# Altium schematic sheet Sheet1.SchDoc: Communications Modules
size A3; DrawnBy: Igor Bubanja, Tim Oorschot; Organization: Group 7; Address1: ECE Department; Address2: University of Canterbury; Address3: Christchurch 8041; Address4: New Zealand; Revision: 1; SheetNumber: 3; SheetTotal: 3
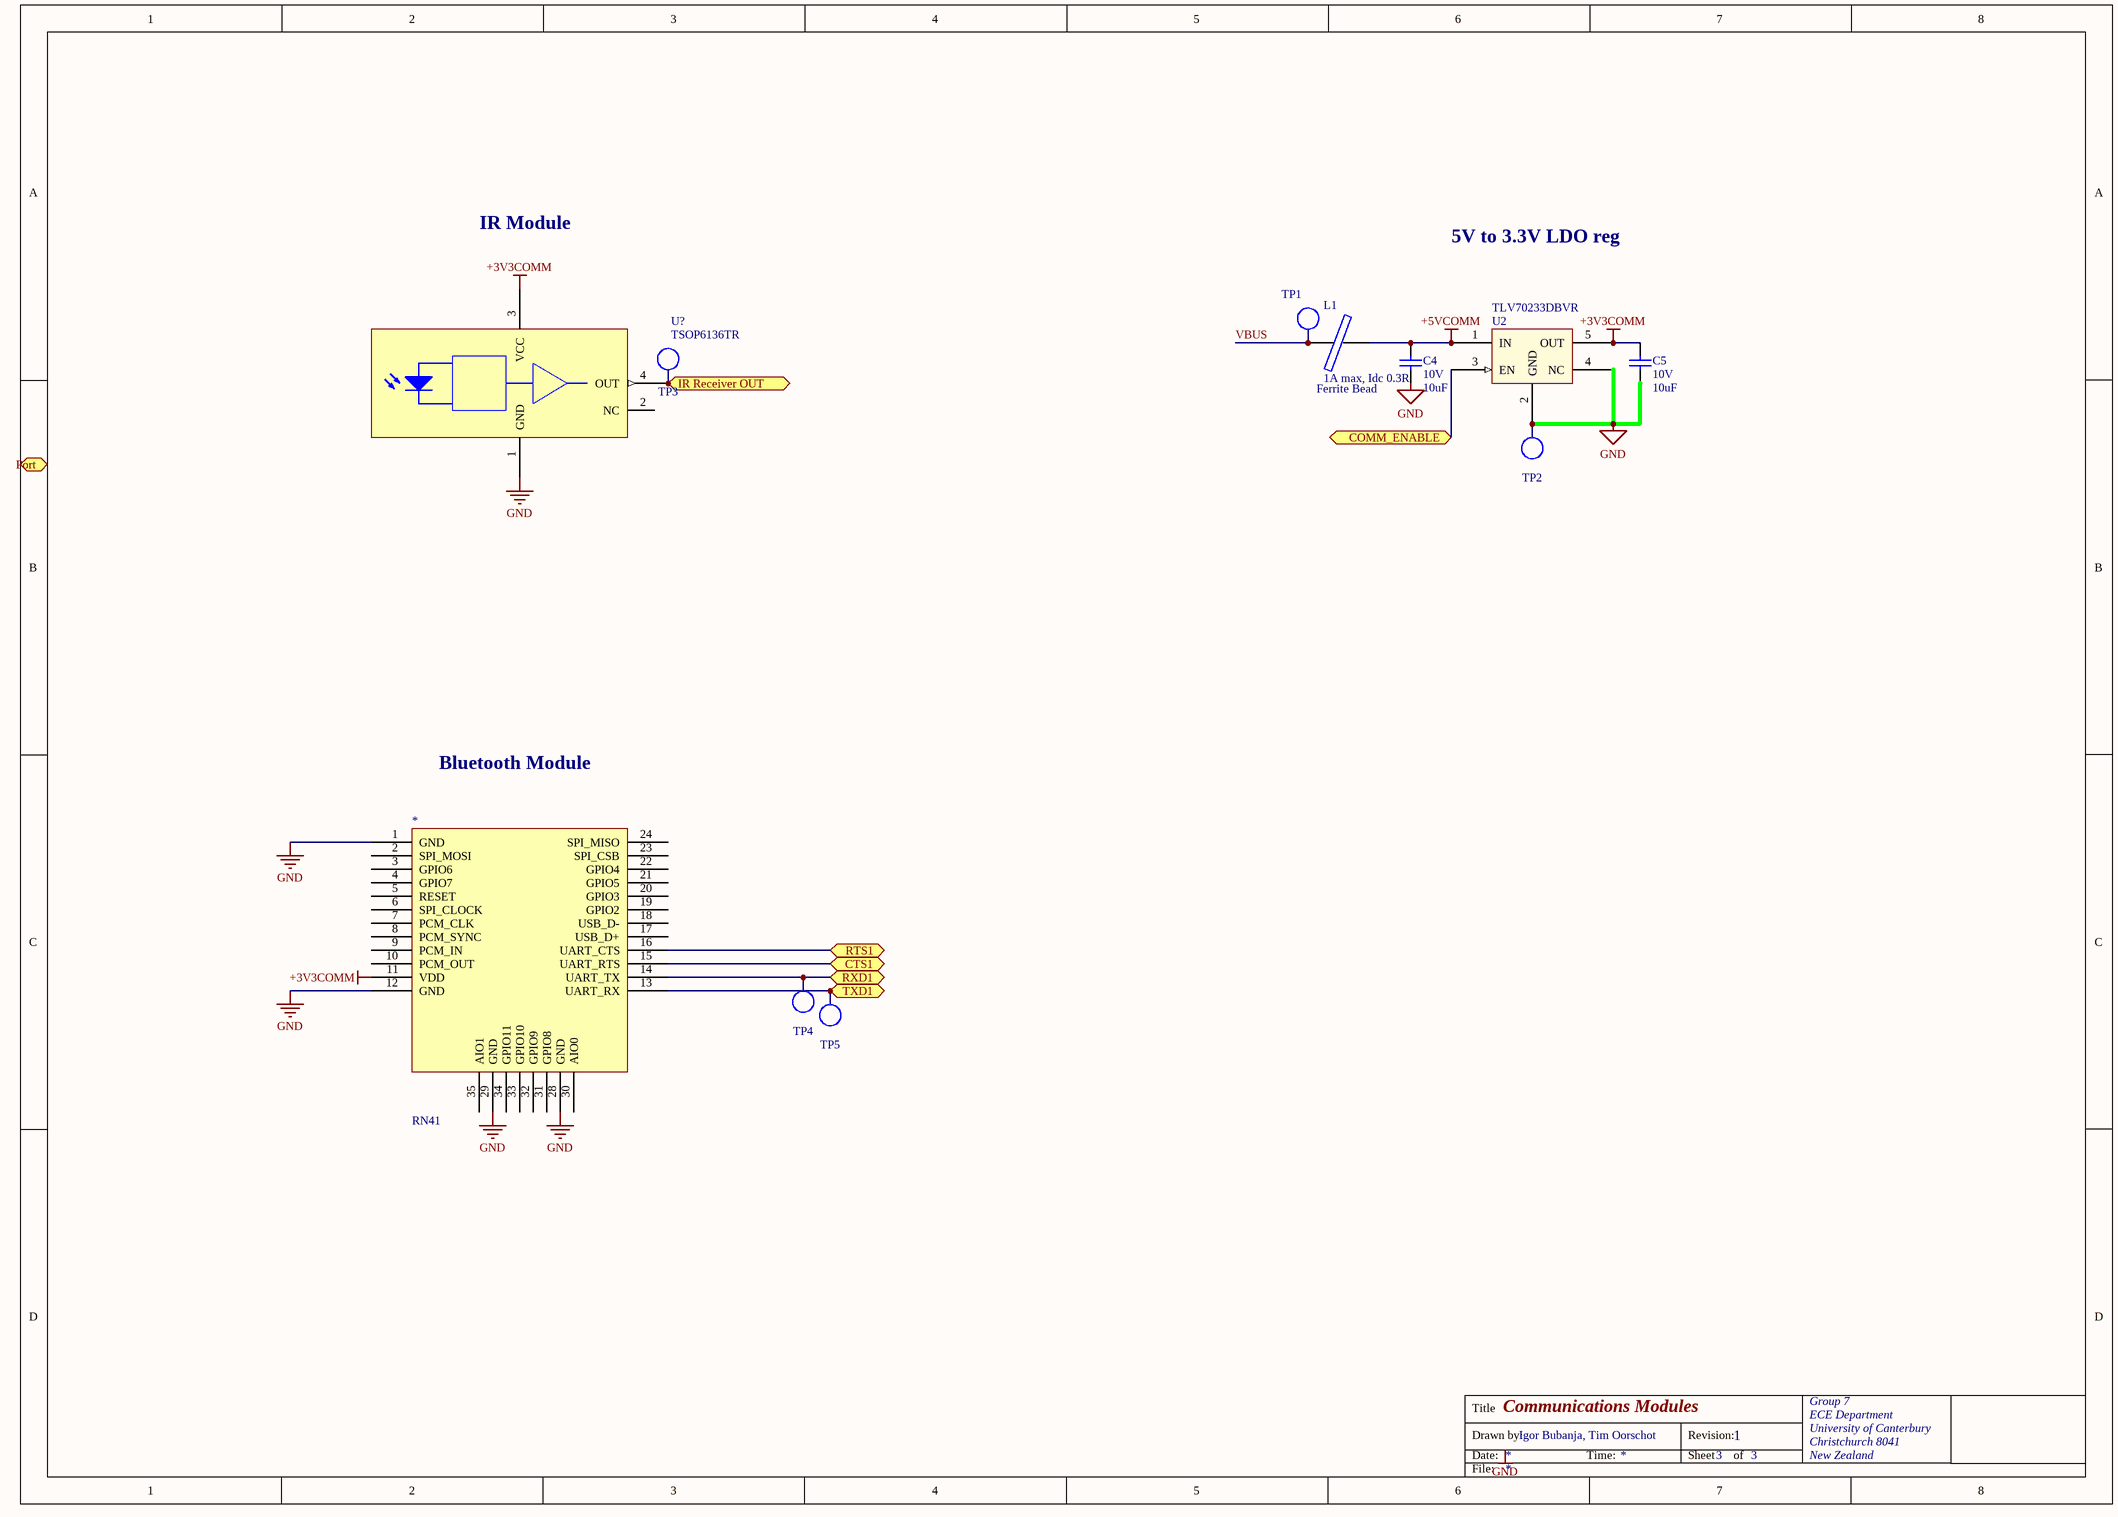
[diagram p0: Sheet1.SchDoc]

## Parts
*  RN41
C4  Voltage - Rated: 10V  [CAPC1608L]  (hidden comment: 10uF)
C5  Voltage - Rated: 10V  [CAPC1608L]  (hidden comment: 10uF)
L1  Ferrite Bead  value 1A max, Idc 0.3R,  [INDC3216L]
TP1  V_Bus  [TP_0805]  (value not drawn)
TP2  Gnd  [TP_0805]  (value not drawn)
TP3  Gnd  [TP_0805]  (value not drawn)
TP4  Gnd  [TP_0805]  (value not drawn)
TP5  Gnd  [TP_0805]  (value not drawn)
U2  TLV70233DBVR  [SOT95P280X145-5N]
U?  TSOP6136TR  [TSOP61]

## Ports
COMM_ENABLE, CTS1, IR Receiver OUT, Port, RTS1, RXD1, TXD1

## Nets
+3V3COMM: *.11(VDD) C5.1 U2.5(OUT) U?.3(VCC)
+5VCOMM: C4.1 L1.2 U2.1(IN)
GND: *.1(GND) *.12(GND) *.28(GND) *.29(GND) C4.2 C5.2 TP2.1(TP) U2.2(GND) U2.4(NC) U?.1(GND)
COMM_ENABLE: U2.3(EN) ; port COMM_ENABLE
CTS1: *.15(UART_RTS) ; port CTS1
IR Receiver OUT: TP3.1(TP) U?.4(OUT) ; port IR Receiver OUT
RTS1: *.16(UART_CTS) ; port RTS1
RXD1: *.14(UART_TX) TP4.1(TP) ; port RXD1
TXD1: *.13(UART_RX) TP5.1(TP) ; port TXD1
VBUS: L1.1 TP1.1(TP)

Not connected (* = marked no-connect by the designer): * 2(SPI_MOSI) 3(GPIO6) 4(GPIO7) 5(RESET) 6(SPI_CLOCK) 7(PCM_CLK) 8(PCM_SYNC) 9(PCM_IN) 10(PCM_OUT) 17(USB_D+) 18(USB_D-) 19(GPIO2) 20(GPIO3) 21(GPIO5) 22(GPIO4) 23(SPI_CSB) 24(SPI_MISO) 30(AIO0) 31(GPIO8) 32(GPIO9) 33(GPIO10) 34(GPIO11) 35(AIO1); U? 2(NC)

## Notes on the sheet
- IR Module
- 5V to 3.3V LDO reg
- Bluetooth Module
- Labels drawn without touching a wire or pin: GND
- Title
- Drawn by:
- Date:
- Time:
- Revision:
- Sheet
- of
- File:

## Library data of the parts
* = RN41: Bluetooth RN41
C4 C5 = CC_10uF_0603: CAP CER 10UF X5R +-20% 10V 0603; Supplier: ECE Dept; Storage Location: PCB Assembly WS; Value: 10uF
L1 = IN_Ferrite-Bead: Ferrite Bead, Rdc 0.3R, Z100MHZ 600R, Imax 1A, SMD 1206; Manufacturer: FAIR-RITE; Manufacturer PN: 2512066017Y1; DC Current Rating: 1; DC Resistance Max: 0.08; Ferrite Case Style: 1206 ^3216 Metric]; Frequency Range: 50MHz to 1; Impedance: 600; Impedance Tolerance: ± 25%; Supplier: ECE Dept; Storage Location: PCB Assembly WS; Ferrite Mounting: SMD; Supplier 1: Farnell; Supplier Part Number 1: 1612060; Manufacturer Part Number: 2512066017Y1
TP1-TP5 = TP_0805: Test Point 2.0X0.9X1.2mm SMD; Manufacturer: TE Connectivity AMP Connectors; Manufacturer Part Number: 1625854-2; Supplier 1: Digi-Key; Mounting Type: Surface Mount; Terminal: 0.079" x 0.049" x 0.057" (2.00mm x 1.25mm x 1.45mm); Type: PC Test Point; Supplier Part Number 1: A106144CT-ND
U2 = SV_TLV70233DBVR: IC REG LDO 3.3V 0.3A SOT23-5; Manufacturer: Texas Instruments; Current - Output: 300mA; Supplier 1: Digi-Key; Operating Temperature: -40°C ~ 125°C; Package / Case: SC-74A, SOT-753; Pricing: 1=0.77, 10=0.647, 25=0.5672, 100=0.4853, 250=0.421, 500=0.35658, 750=0.30789, 1000=0.2749 (NZD); Supplier Part Number 1: 296-32415-1-ND; Manufacturer Part Number: TLV70233DBVR
U? = TSOP6136TR: Infrared Receiver 36KHz; Manufacturer: Vishay Semiconductor Opto Division; Supplier 1: Farnell; Supplier Part Number 1: 1779685; Manufacturers PN: TSOP6136TR; Manufacturer Part Number: TSOP6136TR; Supplier 2: Digi-Key; Supplier Part Number: TSOP6136TR-ND; Supplier Part Number 2: TSOP6136TR-ND